# EAGLE design rt_board (EAGLE 5.10)
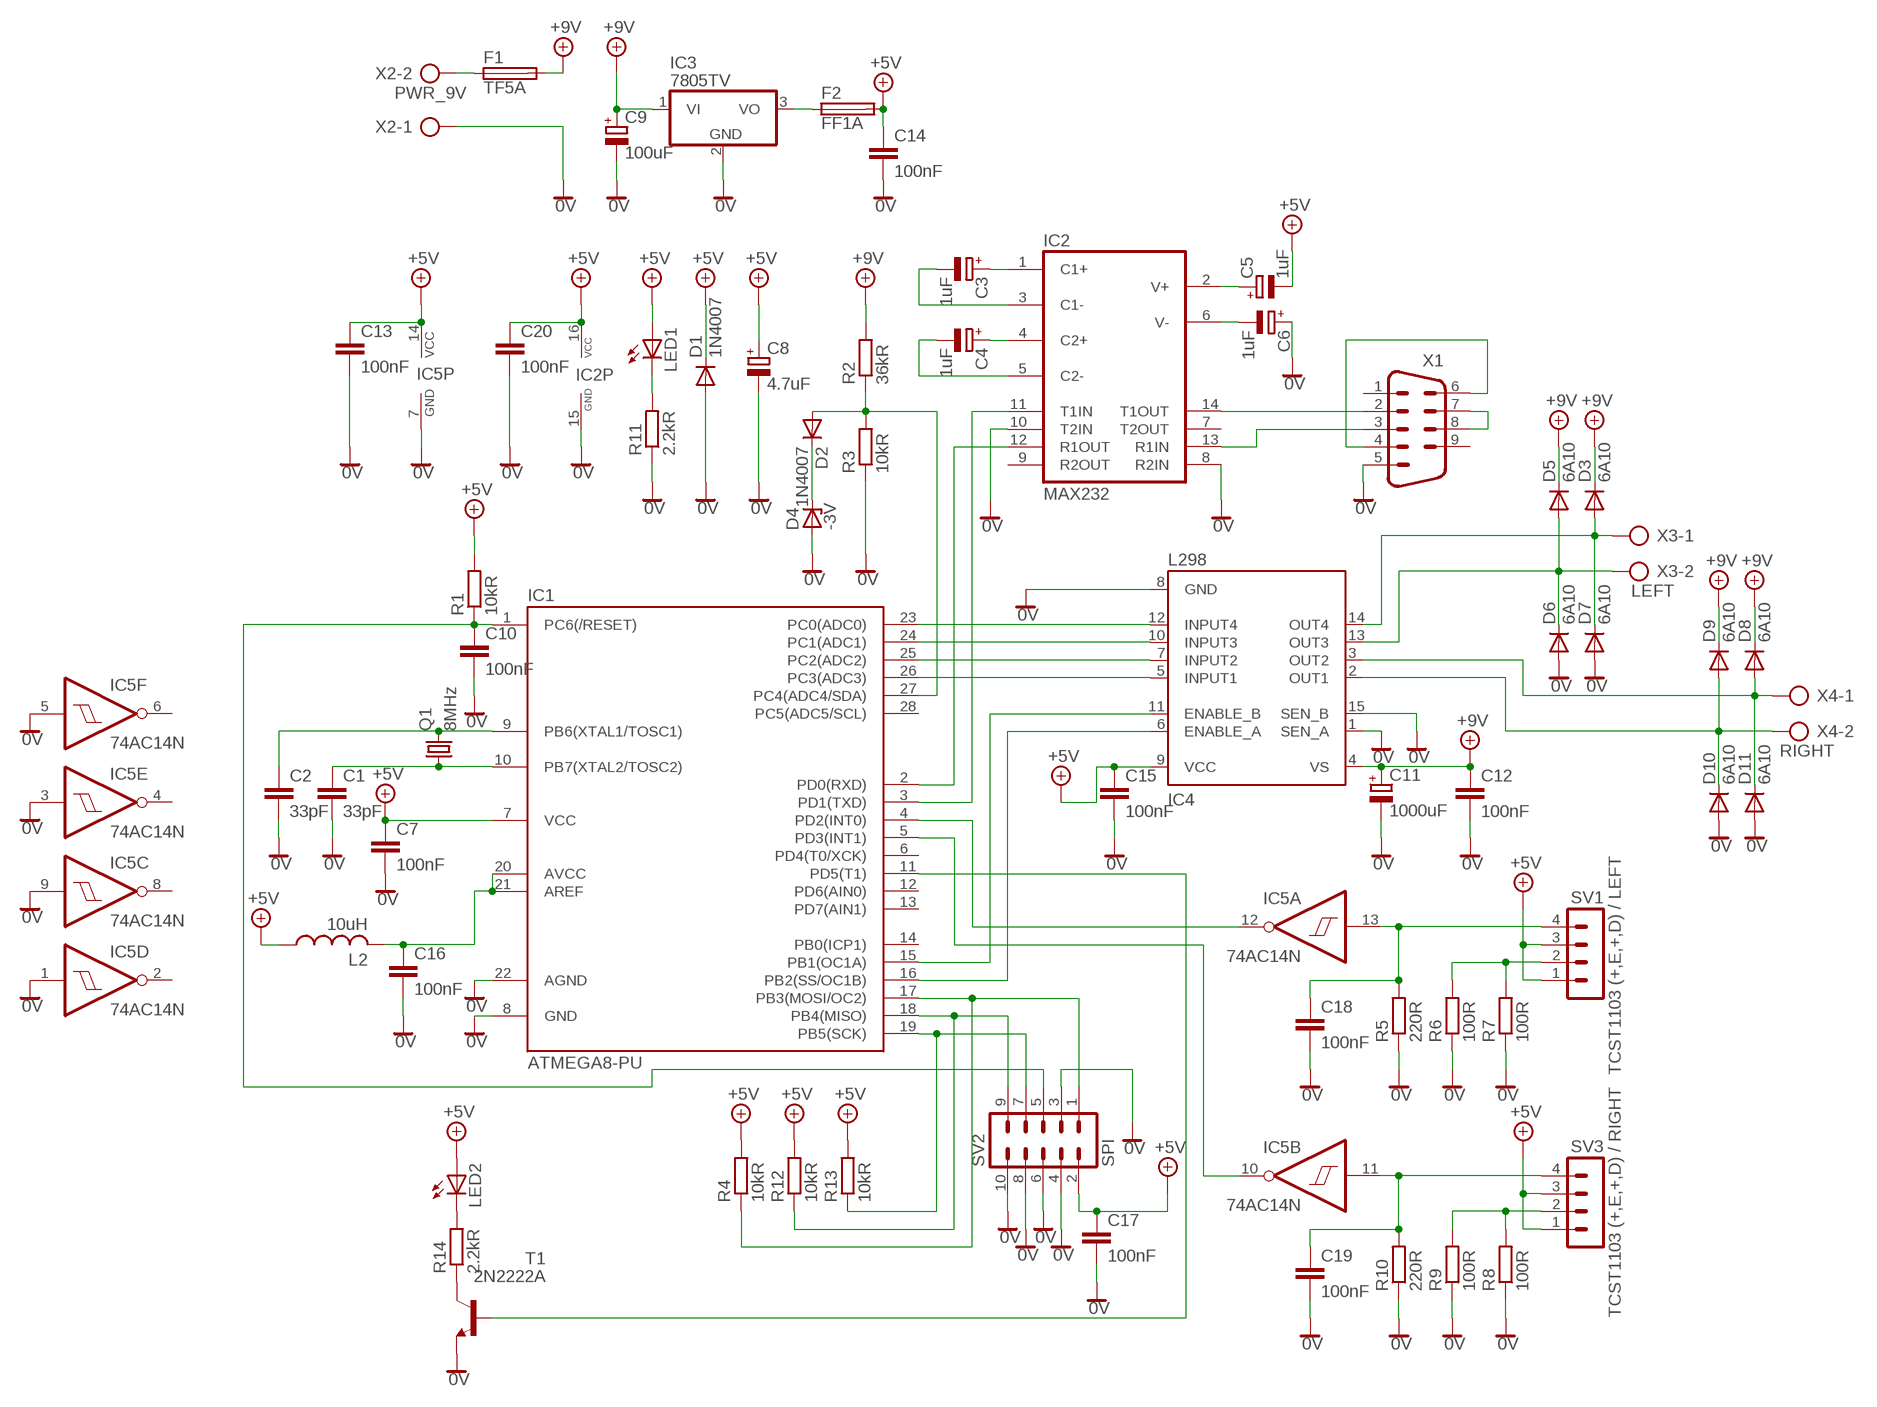
[diagram p0: schematic, sheet 1]

## Parts
C1  33pF  C7.5/3  [C7.5B3]
C2  33pF  C7.5/3  [C7.5B3]
C3  1uF  CPOL-EUE2.5-5  [E2,5-5]
C4  1uF  CPOL-EUE2.5-5  [E2,5-5]
C5  1uF  CPOL-EUE2.5-5  [E2,5-5]
C6  1uF  CPOL-EUE2.5-5  [E2,5-5]
C7  100nF  C7.5/3  [C7.5B3]
C8  4.7uF  CPOL-EUE2.5-7  [E2,5-7]
C9  100uF  CPOL-EUE3.5-10  [E3,5-10]
C10  100nF  C7.5/3  [C7.5B3]
C11  1000uF  CPOL-EUE7.5-16  [E7,5-16]
C12  100nF  C7.5/3  [C7.5B3]
C13  100nF  C7.5/3  [C7.5B3]
C14  100nF  C7.5/3  [C7.5B3]
C15  100nF  C7.5/3  [C7.5B3]
C16  100nF  C7.5/3  [C7.5B3]
C17  100nF  C7.5/3  [C7.5B3]
C18  100nF  C7.5/3  [C7.5B3]
C19  100nF  C7.5/3  [C7.5B3]
C20  100nF  C7.5/3  [C7.5B3]
D1  1N4007  1N4004  [DO41-10]
D2  1N4007  1N4004  [DO41-10]
D3  6A10  UF5400  [DO201-15]
D4  -3V  ZENER-DIODEDO34-7  [DO34Z7]
D5  6A10  UF5400  [DO201-15]
D6  6A10  UF5400  [DO201-15]
D7  6A10  UF5400  [DO201-15]
D8  6A10  UF5400  [DO201-15]
D9  6A10  UF5400  [DO201-15]
D10  6A10  UF5400  [DO201-15]
D11  6A10  UF5400  [DO201-15]
F1  TF5A  SH22  [SH22]
F2  FF1A  SH22  [SH22]
IC1  ATMEGA8-PU  [DIL28-3]
IC2  MAX232  [DIL16]
IC3  7805TV  [TO220V]
IC4  L298  [MULTIWATT-15]
IC5  74AC14N  [DIL14]
L2  10uH  L-US0207/10  [0207/10]
LED1  LED5MM  [LED5MM]
LED2  LED5MM  [LED5MM]
Q1  8MHz  CRYSTALHC49U-V  [HC49U-V]
R1  10kR  R-EU_0207/12  [0207/12]
R2  36kR  R-EU_0207/12  [0207/12]
R3  10kR  R-EU_0207/12  [0207/12]
R4  10kR  R-EU_0207/12  [0207/12]
R5  220R  R-EU_0207/12  [0207/12]
R6  100R  R-EU_0207/12  [0207/12]
R7  100R  R-EU_0207/12  [0207/12]
R8  100R  R-EU_0207/12  [0207/12]
R9  100R  R-EU_0207/12  [0207/12]
R10  220R  R-EU_0207/12  [0207/12]
R11  2.2kR  R-EU_0207/12  [0207/12]
R12  10kR  R-EU_0207/12  [0207/12]
R13  10kR  R-EU_0207/12  [0207/12]
R14  2.2kR  R-EU_0207/12  [0207/12]
SV1  TCST1103 (+,E,+,D) / LEFT  MA04-1  [MA04-1]
SV2  SPI  ML10  [ML10]
SV3  TCST1103 (+,E,+,D) / RIGHT  MA04-1  [MA04-1]
T1  2N2222A  2N2222A-NPN-TO18-EBC  [TO18]
X1  M09HP  [M09HP]
X2  PWR_9V  AK300/2  [AK300/2]
X3  LEFT  AK300/2  [AK300/2]
X4  RIGHT  AK300/2  [AK300/2]

## Nets
0V: C1.2 C2.2 C6.+ C7.2 C8.- C9.- C10.2 C11.- C12.2 C13.2 C14.2 C15.2 C16.2 C17.2 C18.2 C19.2 C20.2 D1.A D4.A D6.A D7.A D10.A D11.A IC1.8(GND) IC1.22(AGND) IC2.8(R2IN) IC2.10(T2IN) IC2.15(GND) IC3.2(GND) IC4.1(SEN_A) IC4.8(GND) IC4.15(SEN_B) IC5.1(D:I) IC5.3(E:I) IC5.5(F:I) IC5.7(P:GND) IC5.9(C:I) R3.1 R5.1 R6.1 R7.1 R8.1 R9.1 R10.1 R11.1 SV2.3 SV2.4 SV2.6 SV2.8 SV2.10 T1.1(E) X1.5 X2.1
+5V: C5.- C7.1 C8.+ C13.1 C14.1 C15.1 C17.1 C20.1 D1.C F2.2 IC1.7(VCC) IC2.16(VCC) IC4.9(VCC) IC5.14(P:VCC) L2.1 LED1.A LED2.A R1.2 R4.2 R12.2 R13.2 SV1.1 SV1.3 SV2.2 SV3.1 SV3.3
+9V: C9.+ C11.+ C12.1 D3.C D5.C D8.C D9.C F1.2 IC3.1(VI) IC4.4(VS) R2.2
N$1: C2.1 IC1.9(PB6(XTAL1/TOSC1)) Q1.2
N$2: C1.1 IC1.10(PB7(XTAL2/TOSC2)) Q1.1
N$3: C10.1 IC1.1(PC6(/RESET)) R1.1 SV2.5
N$4: IC1.2(PD0(RXD)) IC2.12(R1OUT)
N$5: IC1.3(PD1(TXD)) IC2.11(T1IN)
N$6: C3.+ IC2.1(C1+)
N$7: C4.+ IC2.4(C2+)
N$8: C5.+ IC2.2(V+)
N$9: C6.- IC2.6(V-)
N$10: C3.- IC2.3(C1-)
N$11: C4.- IC2.5(C2-)
N$12: IC2.14(T1OUT) X1.2
N$13: IC2.13(R1IN) X1.3
N$14: D2.C D4.C
N$15: X1.7 X1.8
N$16: X1.4 X1.6
N$17: IC1.23(PC0(ADC0)) IC4.12(INPUT4)
N$18: IC1.24(PC1(ADC1)) IC4.10(INPUT3)
N$19: IC1.25(PC2(ADC2)) IC4.7(INPUT2)
N$20: IC1.26(PC3(ADC3)) IC4.5(INPUT1)
N$21: IC1.15(PB1(OC1A)) IC4.11(ENABLE_B)
N$22: IC1.16(PB2(SS/OC1B)) IC4.6(ENABLE_A)
N$24: F1.1 X2.2
N$25: D2.A IC1.27(PC4(ADC4/SDA)) R2.1 R3.2
N$27: IC1.4(PD2(INT0)) IC5.12(A:O)
N$28: IC1.5(PD3(INT1)) IC5.10(B:O)
N$29: IC1.18(PB4(MISO)) R12.1 SV2.9
N$30: IC1.19(PB5(SCK)) R13.1 SV2.7
N$31: IC1.17(PB3(MOSI/OC2)) R4.1 SV2.1
N$32: C18.1 IC5.13(A:I) R5.2 SV1.4
N$33: R6.2 R7.2 SV1.2
N$34: F2.1 IC3.3(VO)
N$35: D3.A D7.C IC4.14(OUT4) X3.1
N$36: D5.A D6.C IC4.13(OUT3) X3.2
N$37: D8.A D11.C IC4.3(OUT2) X4.1
N$38: D9.A D10.C IC4.2(OUT1) X4.2
N$39: C19.1 IC5.11(B:I) R10.2 SV3.4
N$40: R8.2 R9.2 SV3.2
N$41: LED1.K(C) R11.2
N$46: LED2.K(C) R14.2
N$47: C16.1 IC1.20(AVCC) IC1.21(AREF) L2.2
N$48: R14.1 T1.3(C)
N$49: IC1.11(PD5(T1)) T1.2(B)
Unconnected: IC1.6(PD4(T0/XCK)) IC1.12(PD6(AIN0)) IC1.13(PD7(AIN1)) IC1.14(PB0(ICP1)) IC1.28(PC5(ADC5/SCL)) IC2.7(T2OUT) IC2.9(R2OUT) IC5.2(D:O) IC5.4(E:O) IC5.6(F:O) IC5.8(C:O) X1.1 X1.9

## Library data of the parts
C1 C2 C7 C10 C12-C20 = capacitor-wima:C: CAPACITOR naming: grid - package width
C3-C6 C8 C9 C11 = rcl:CPOL-EU: POLARIZED CAPACITOR, European symbol
D1 D2 = diode:1N4004: DIODE general purpose rectifier, 1 A
D3 D5-D11 = diode:UF5400: DIODE ultra fast rectifier, 3 A
D4 = diode:ZENER-DIODE: Z-Diode
F1 F2 = fuse:SH22: FUSE HOLDER CS PFP30, Schukat
IC1 = atmega8:ATMEGA8-PU
IC2 = maxim:MAX232: RS232 TRANSEIVER
IC3 = linear:78*: Positive VOLTAGE REGULATOR Source: http://cache.national.com/ds/LM/LM78L05.pdf http://www.fairchildsemi.com/ds/LM/LM7805.pdf
IC4 = st-microelectronics:L298: DUAL FULL-BRIDGE DRIVER
IC5 = 74xx-eu:74*14: Hex schmitt trigger INVERTER
L2 = rcl:L-US: INDUCTOR, American symbol
LED1 LED2 = led:LED: LED OSRAM: - CHIPLED LG R971, LG N971, LY N971, LG Q971, LY Q971, LO R971, LY R971 LH N974, LH R974 LS Q976, LO Q976, LY Q976 LO Q996 - Hyper CHIPLED LW Q18S LB Q993, LB Q99A, LB R99A - SideLED LS A670, LO A670, LY A670, LG A670, LP A670 LB A673, LV A673, LT A673, LW A673 LH A674 LY A675 LS A676, LA A676, LO A676, LY A676, LW A676 LS A679, LY A679, LG A679 - Hyper Micro SIDELED® LS Y876, LA Y876, LO Y876, LY Y876 LT Y87S - SmartLED LW L88C, LW L88S LB L89C, LB L89S, LG L890 LS L89K, LO L89K, LY L89K LS L896, LA L896, LO L896, LY L896 - TOPLED LS T670, LO T670, LY T670, LG T670, LP T670 LSG T670, LSP T670, LSY T670, LOP T670, LYG T670 LG T671, LOG T671, LSG T671 LB T673, LV T673, LT T673, LW T673 LH T674 LS T676, LA T676, LO T676, LY T676, LB T676, LH T676, LSB T676, LW T676 LB T67C, LV T67C, LT T67C, LS T67K, LO T67K, LY T67K, LW E67C LS E67B, LA E67B, LO E67B, LY E67B, LB E67C, LV E67C, LT E67C LW T67C LS T679, LY T679, LG T679 LS T770, LO T770, LY T770, LG T770, LP T770 LB T773, LV T773, LT T773, LW T773 LH T774 LS E675, LA E675, LY E675, LS T675 LS T776, LA T776, LO T776, LY T776, LB T776 LHGB T686 LT T68C, LB T68C - Hyper Mini TOPLED® LB M676 - Mini TOPLED Santana® LG M470 LS M47K, LO M47K, LY M47K Source: http://www.osram.convergy.de LUXEON: - LUMILED® LXK2-PW12-R00, LXK2-PW12-S00, LXK2-PW14-U00, LXK2-PW14-V00 LXK2-PM12-R00, LXK2-PM12-S00, LXK2-PM14-U00 LXK2-PE12-Q00, LXK2-PE12-R00, LXK2-PE12-S00, LXK2-PE14-T00, LXK2-PE14-U00 LXK2-PB12-K00, LXK2-PB12-L00, LXK2-PB12-M00, LXK2-PB14-N00, LXK2-PB14-P00, LXK2-PB14-Q00 LXK2-PR12-L00, LXK2-PR12-M00, LXK2-PR14-Q00, LXK2-PR14-R00 LXK2-PD12-Q00, LXK2-PD12-R00, LXK2-PD12-S00 LXK2-PH12-R00, LXK2-PH12-S00 LXK2-PL12-P00, LXK2-PL12-Q00, LXK2-PL12-R00 Source: www.luxeon.com KINGBRIGHT: KA-3528ASYC Source: www.kingbright.com
Q1 = crystal:CRYSTAL: CRYSTAL
R1-R14 = resistor:R-EU_: RESISTOR, European symbol
SV1 SV3 = con-lstb:MA04-1: PIN HEADER
SV2 = con-harting-ml:ML10: HARTING
T1 = transistor-neu-to92:*-NPN-: NPN Transistror
X1 = con-subd:M09: SUB-D
X2-X4 = con-ptr500:AK300/2: CONNECTOR

## Board
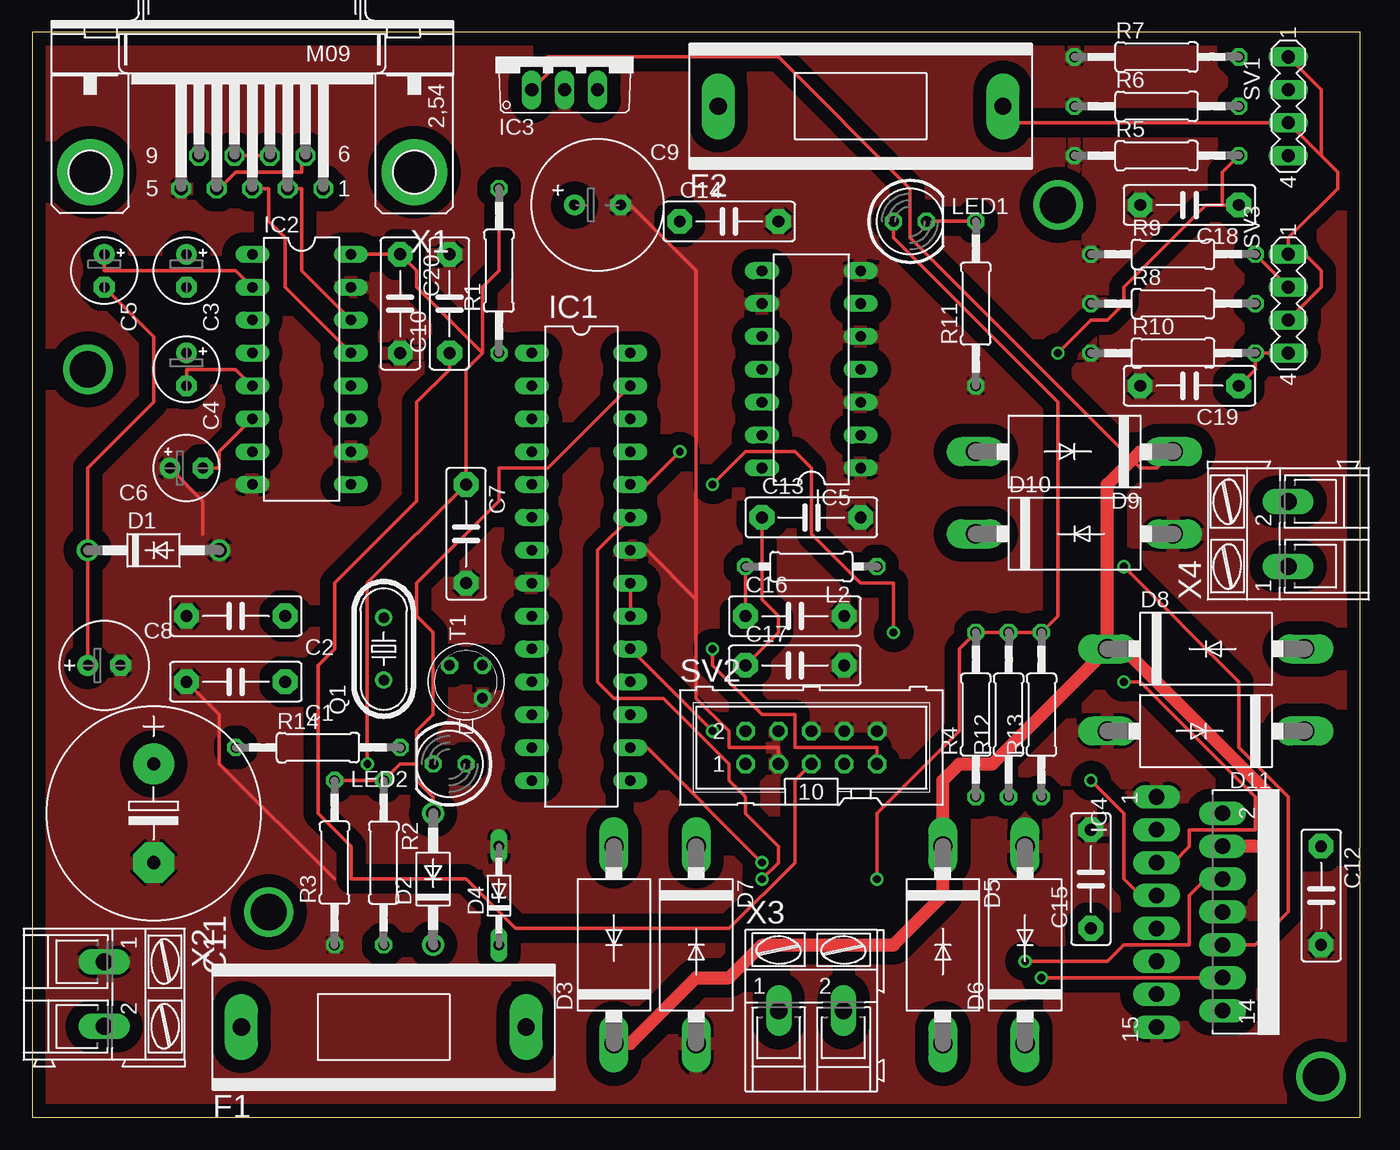
[diagram p1: board, top side]
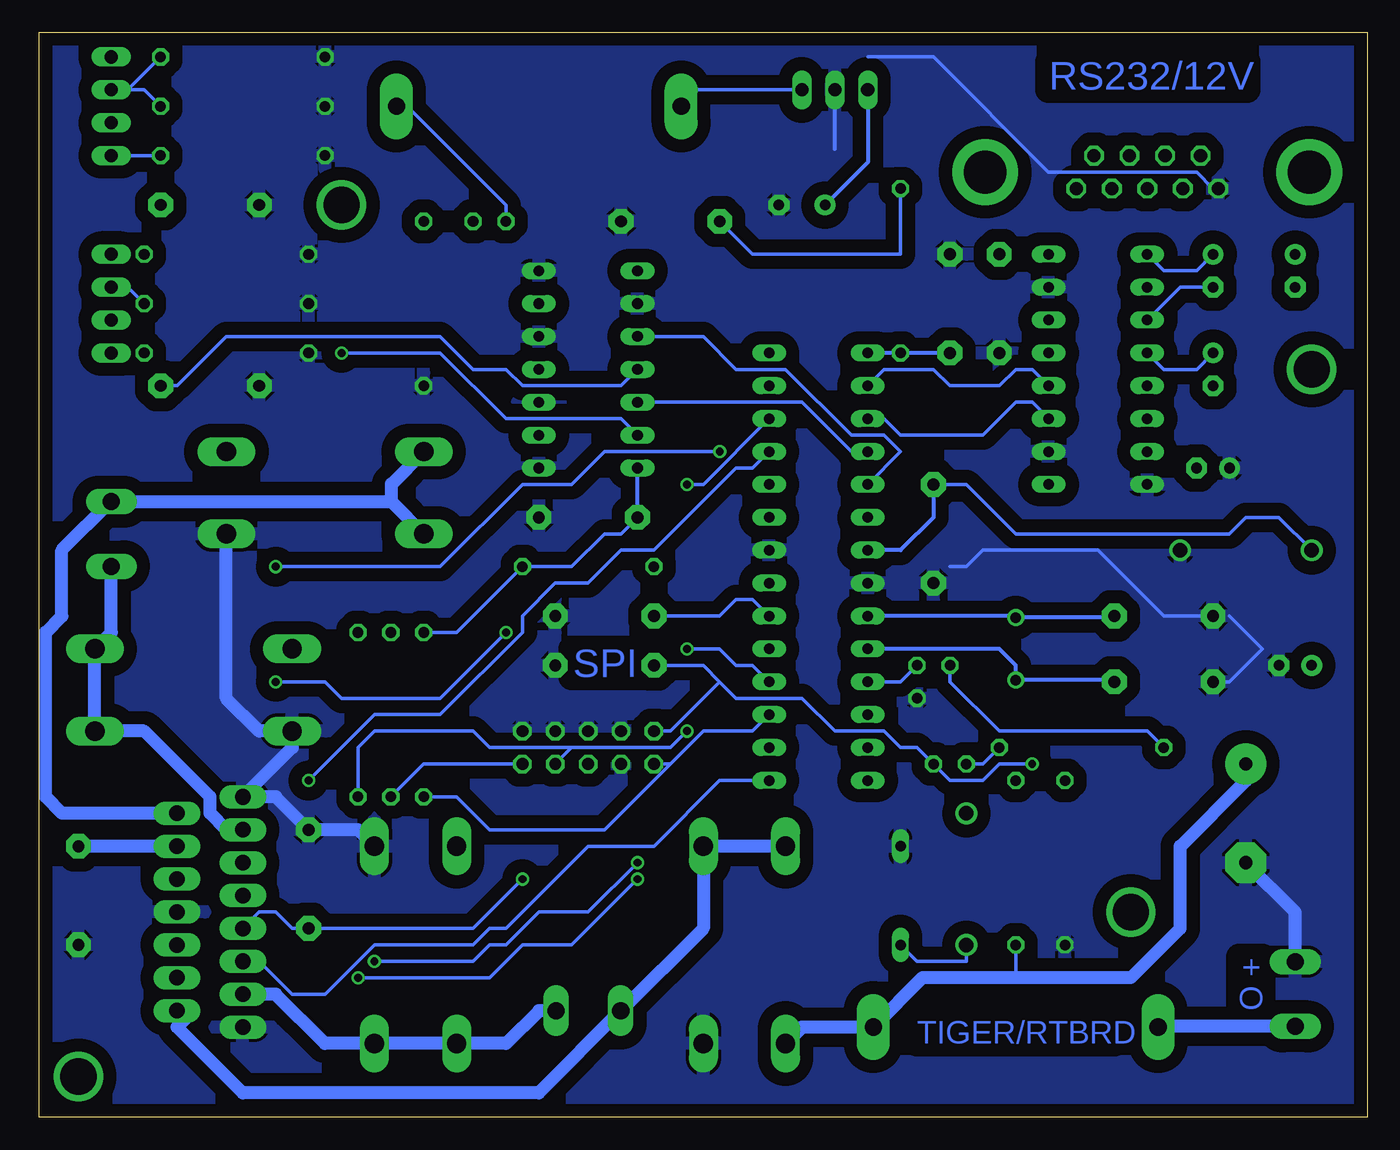
[diagram p2: board, bottom side, seen from below]

Size 102.54 x 83.81 mm. Coordinates in mm from the lower left corner, seen from the top.
Outline: 0,0 102.54,0 102.54,83.81 0,83.81 0,0
Copper layers (1*16): Top 0.035mm / dielectric 1.5mm / Bottom 0.035mm
Design rules "default": minimum track width 10mil, minimum drill 24mil, track to track 8mil, track to pad 8mil, pad to pad 8mil, via to via 8mil, smd to smd 8mil, copper to edge 40mil, drill to drill 8mil, minimum pad ring 10mil, minimum via ring 8mil, stop-mask expansion 4mil, vias tented up to drill 0mil, thermal gap 10mil

### Footprints (pad centres in the part's own frame; a part is rotated, then mirrored left to right if it is on the bottom)
C7.5B3 = drill 0.914 pad 1.905 octagon: 1 -3.81,0; 2 3.81,0
E2,5-5 = drill 0.813 pad 1.6 round: + -1.27,0 | drill 0.813 pad 1.6 octagon: - 1.27,0
E2,5-7 = drill 0.813 pad 1.6 round: + -1.27,0 | drill 0.813 pad 1.6 octagon: - 1.27,0
E3,5-10 = drill 0.813 pad 1.6 round: + -1.778,0 | drill 0.813 pad 1.6 octagon: - 1.778,0
E7,5-16 = drill 1.016 pad 3.15 round: + -3.81,0 | drill 1.016 pad 3.15 octagon: - 3.81,0
DO41-10 = drill 1.118 round: A 5.08,0; C -5.08,0
DO201-15 = drill 1.499 long: A 7.62,0; C -7.62,0
DO34Z7 = drill 0.813 long: A 3.81,0; C -3.81,0
SH22 = drill 1.321 pad 2.54 long: 1 -10.998,0; 2 10.998,0
DIL28-3 = drill 0.813 long: 1 -16.51,-3.81; 2 -13.97,-3.81; 3 -11.43,-3.81; 4 -8.89,-3.81; 5 -6.35,-3.81; 6 -3.81,-3.81; 7 -1.27,-3.81; 8 1.27,-3.81; 9 3.81,-3.81; 10 6.35,-3.81; 11 8.89,-3.81; 12 11.43,-3.81; 13 13.97,-3.81; 14 16.51,-3.81; 15 16.51,3.81; 16 13.97,3.81; 17 11.43,3.81; 18 8.89,3.81; 19 6.35,3.81; 20 3.81,3.81; 21 1.27,3.81; 22 -1.27,3.81; 23 -3.81,3.81; 24 -6.35,3.81; 25 -8.89,3.81; 26 -11.43,3.81; 27 -13.97,3.81; 28 -16.51,3.81
DIL16 = drill 0.813 long: 1 -8.89,-3.81; 2 -6.35,-3.81; 3 -3.81,-3.81; 4 -1.27,-3.81; 5 1.27,-3.81; 6 3.81,-3.81; 7 6.35,-3.81; 8 8.89,-3.81; 9 8.89,3.81; 10 6.35,3.81; 11 3.81,3.81; 12 1.27,3.81; 13 -1.27,3.81; 14 -3.81,3.81; 15 -6.35,3.81; 16 -8.89,3.81
TO220V = drill 1.016 long: 1 -2.54,-2.54; 2 0,-2.54; 3 2.54,-2.54
MULTIWATT-15 = drill 1.2 long: 1 -8.89,-7.62; 2 -7.62,-2.54; 3 -6.35,-7.62; 4 -5.08,-2.54; 5 -3.81,-7.62; 6 -2.54,-2.54; 7 -1.27,-7.62; 8 0,-2.54; 9 1.27,-7.62; 10 2.54,-2.54; 11 3.81,-7.62; 12 5.08,-2.54; 13 6.35,-7.62; 14 7.62,-2.54; 15 8.89,-7.62
DIL14 = drill 0.813 long: 1 -7.62,-3.81; 2 -5.08,-3.81; 3 -2.54,-3.81; 4 0,-3.81; 5 2.54,-3.81; 6 5.08,-3.81; 7 7.62,-3.81; 8 7.62,3.81; 9 5.08,3.81; 10 2.54,3.81; 11 0,3.81; 12 -2.54,3.81; 13 -5.08,3.81; 14 -7.62,3.81
0207/10 = drill 0.813 octagon: 1 -5.08,0; 2 5.08,0
LED5MM = drill 0.813 octagon: A -1.27,0; K 1.27,0
HC49U-V = drill 0.813 round: 1 -2.413,0; 2 2.413,0
0207/12 = drill 0.813 octagon: 1 -6.35,0; 2 6.35,0
MA04-1 = drill 1.016 long: 1 -3.81,0; 2 -1.27,0; 3 1.27,0; 4 3.81,0
ML10 = drill 0.914 octagon: 1 -5.08,-1.27; 2 -5.08,1.27; 3 -2.54,-1.27; 4 -2.54,1.27; 5 0,-1.27; 6 0,1.27; 7 2.54,-1.27; 8 2.54,1.27; 9 5.08,-1.27; 10 5.08,1.27
TO18 = drill 0.813 octagon: 1 -1.27,-1.27; 2 1.27,-1.27; 3 1.27,1.27
M09HP = drill 1.016 octagon: 1 -5.486,1.27; 2 -2.743,1.27; 3 0,1.27; 4 2.743,1.27; 5 5.486,1.27; 6 -4.115,-1.27; 7 -1.372,-1.27; 8 1.372,-1.27; 9 4.115,-1.27 | drill 3.302 pad 5.08 round: G1 -12.522,0; G2 12.522,0
AK300/2 = drill 1.321 long: 1 -2.515,0; 2 2.489,0

### Placement (x,y rotation side)
C1  15.71,33.65 180 top
C2  15.71,38.73 180 top
C3  11.9,65.4 270 top
C4  11.9,57.78 270 top
C5  5.55,65.4 270 top
C6  11.9,50.16 0 top
C7  33.49,45.08 270 top
C8  5.55,34.92 0 top
C9  43.65,70.48 0 top
C10  32.22,62.86 90 top
C11  9.36,23.49 270 top
C12  99.53,17.14 270 top
C13  60.16,46.35 0 top
C14  53.81,69.21 0 top
C15  81.75,18.41 90 top
C16  58.89,38.73 0 top
C17  58.89,34.92 0 top
C18  89.37,70.48 180 top
C19  89.37,56.51 180 top
C20  28.41,62.86 270 top
D1  9.36,43.81 0 top
D2  30.95,18.41 90 top
D3  44.92,13.33 90 top
D4  36.03,17.14 90 top
D5  70.32,13.33 270 top
D6  76.67,13.33 90 top
D7  51.27,13.33 270 top
D8  90.64,36.19 0 top
D9  80.48,51.43 180 top
D10  80.48,45.08 0 top
D11  90.64,29.84 180 top
F1  27.14,6.98 0 top
F2  63.97,78.1 0 top
IC1  42.38,42.54 270 top
IC2  20.79,57.78 270 top
IC3  41.11,81.91 0 top
IC4  94.45,15.87 270 top
IC5  60.16,57.78 90 top
L2  60.16,42.54 180 top
LED1  67.78,69.21 0 top
LED2  32.22,27.3 180 top
Q1  27.14,36.19 90 top
R1  36.03,65.4 90 top
R2  27.14,19.68 270 top
R3  23.33,19.68 90 top
R4  72.86,31.11 90 top
R5  86.83,74.29 0 top
R6  86.83,78.1 0 top
R7  86.83,81.91 0 top
R8  88.1,62.86 0 top
R9  88.1,66.67 0 top
R10  88.1,59.05 0 top
R11  72.86,62.86 90 top
R12  75.4,31.11 90 top
R13  77.94,31.11 90 top
R14  22.06,28.57 0 top
SV1  96.99,78.1 270 top
SV2  60.16,28.57 0 top
SV3  96.99,62.86 270 top
T1  33.49,33.65 90 top
X1  16.98,73.02 180 top
X2  5.55,9.52 270 top
X3  60.16,8.25 0 top
X4  96.99,45.08 90 top

### Tracks (layer width: path | path; a pad name or v marks a point on that pad's centre or on a via)
0V
  Top 0.254: C6.+ 13.17,47.62 13.17,45.08 | 51.27,40 51.27,32.38 53.81,29.84 53.81,28.57 57.62,28.57 SV2.3 | 51.27,40 47.46,43.81 IC1.22 | 46.19,70.48 51.27,65.4 51.27,40 | 23.33,18.41 14.44,27.3 14.44,31.11 C1.2
  Bottom 0.254: 38.57,81.91 33.49,81.91 24.6,73.02 13.17,73.02 11.9,71.75 X1.5 | 32.22,42.54 30.95,42.54 29.68,43.81 20.79,43.81 15.71,38.73 C2.2 | 10.63,38.73 8.09,36.19 10.63,33.65 C1.2
  Bottom 0.305: 41.11,74.8 IC3.2
  Bottom 1.016: D10.A 88.1,32.38 85.56,29.84 D11.A 83.02,28.57 IC4.1 84.29,24.76 C15.2 77.94,22.22 D6.A | X2.1 5.55,15.87 C11.-
  pour Bottom (isolate 1.016): 0.47,0.63 0.47,83.18 102.07,83.18 102.07,0.63
  pour Top (isolate 1.016): 0.47,0.63 0.47,83.18 102.07,83.18 102.07,0.63
+5V  (via drill 0.61)
  Top 0.254: v65.24,18.41 65.24,23.49 71.59,29.84 71.59,36.19 R4.2 R12.2 R13.2 79.21,38.73 79.21,55.24 66.51,67.94 LED1.A | C17.1 57.62,37.46 57.62,38.73 56.35,40 C13.1 | C8.+ D1.C 4.28,50.16 9.36,55.24 9.36,60.32 C5.- | 34.76,59.05 33.49,57.78 C7.1 25.87,41.27 v25.87,27.3 | 34.76,59.05 34.76,64.13 36.03,65.4 R1.2 | IC2.16 C20.1 29.68,65.4 29.68,64.13 34.76,59.05 | SV3.3 99.53,64.13 99.53,65.4 98.26,66.67 SV3.1 96.99,67.94 100.8,71.75 100.8,73.02 99.53,74.29 | 99.53,74.29 SV1.3 75.4,76.83 75.4,78.1 F2.2 | SV1.1 99.53,79.37 99.53,74.29
  Bottom 0.254: 50,33.65 51.27,34.92 C17.1 | 50,33.65 48.73,32.38 43.65,32.38 41.11,29.84 37.3,29.84 36.03,28.57 34.76,28.57 LED2.A 32.22,26.03 29.68,26.03 28.41,27.3 v25.87,27.3 | SV2.2 53.81,29.84 50,33.65 | IC4.9 85.56,15.87 84.29,15.87 83.02,14.6 C15.1 69.05,14.6 v65.24,18.41 | R4.2 70.32,37.46 L2.1 61.43,42.54 58.89,45.08 57.62,45.08 C13.1 | R1.2 36.03,66.67 47.46,66.67 C14.1 | D1.C 6.82,46.35 9.36,46.35 10.63,45.08 27.14,45.08 30.95,48.89 C7.1 | LED1.A 66.51,70.48 74.13,78.1 F2.2
  Bottom 0.305: C7.1 33.49,46.35 36.03,43.81 IC1.7 | C13.1 IC5.14
+9V
  Top 0.254: D9.C 86.83,50.16 85.56,50.16 67.78,67.94 67.78,71.75 57.62,81.91 39.84,81.91 39.84,80.64 IC3.1
  Top 1.016: D9.C 85.56,51.43 83.02,48.89 D8.C | D8.C 84.29,36.19 95.72,24.76 95.72,20.95 IC4.4 | D3.C 46.19,5.71 51.27,10.79 53.81,10.79 56.35,13.33 66.51,13.33 70.32,17.14 D5.C 70.32,26.03 71.59,27.3 74.13,27.3 D8.C
  Bottom 0.254: 27.14,10.79 R2.2
  Bottom 0.305: IC3.1 38.57,73.78 C9.+
  Bottom 1.016: D3.C 43.65,6.98 F1.2 34.33,10.79 27.14,10.79 18.25,10.79 14.44,14.6 14.44,20.95 9.36,26.03 C11.+ | IC4.4 C12.1
N$1
  Bottom 0.305: IC1.9 27.27,38.73 Q1.2 19.65,38.6 C2.1
N$2
  Bottom 0.305: IC1.10 28.41,36.19 27.14,34.92 Q1.1 19.65,33.78 C1.1
N$3
  Top 0.254: SV2.5 58.89,26.03 58.89,19.68 53.81,14.6 37.3,14.6 33.49,18.41 24.6,18.41 24.6,20.95 22.06,23.49 22.06,34.92 23.33,36.19 23.33,41.27 29.68,47.62 29.68,55.24 32.22,57.78 C10.1
  Bottom 0.305: IC1.1 R1.1 C10.1
N$4
  Bottom 0.254: IC2.12 25.87,57.78 27.14,57.78 28.41,56.51 32.22,56.51 33.49,57.78 37.3,57.78 IC1.2
N$5
  Bottom 0.254: IC2.11 25.87,55.24 27.14,55.24 29.68,52.7 36.03,52.7 37.3,53.97 IC1.3
N$6
  Bottom 0.254: IC2.1 15.71,65.4 13.17,65.4 C3.+
N$7
  Bottom 0.254: IC2.4 15.71,57.78 13.17,57.78 C4.+
N$8
  Top 0.254: IC2.2 15.71,65.4 5.55,65.4 C5.+
N$9
  Top 0.254: IC2.6 14.44,51.43 14.44,50.16 C6.-
N$10
  Bottom 0.254: IC2.3 14.44,64.13 C3.-
N$11
  Top 0.254: IC2.5 15.71,57.78 11.9,57.78 C4.-
N$12
  Top 0.254: IC2.14 20.79,65.4 20.79,71.75 X1.2 19.52,71.75
N$13
  Top 0.254: IC2.13 19.52,64.13 19.52,67.94 18.25,69.21 18.25,71.75 X1.3
N$14
  Bottom 0.254: D4.C 34.76,12.06 30.95,12.06 D2.C
N$15
  Top 0.254: X1.8 X1.7
N$16
  Top 0.254: X1.4 14.44,71.75 15.71,73.02 20.79,73.02 20.79,74.29 X1.6
N$17  (via drill 0.61)
  Top 0.254: IC1.23 43.65,43.81 43.65,33.65 44.92,32.38 48.73,32.38 53.81,27.3 53.81,26.03 55.08,24.76 55.08,23.49 57.62,20.95 57.62,19.68 v56.35,18.41 | v77.94,10.79 IC4.12
  Bottom 0.254: v56.35,18.41 61.43,13.33 65.24,13.33 67.78,10.79 v77.94,10.79
N$18  (via drill 0.61)
  Top 0.254: IC1.24 47.46,48.89 v50,51.43 | v84.29,42.54 93.18,33.65 93.18,28.57 96.99,24.76 96.99,15.87 94.45,13.33 IC4.10
  Bottom 0.254: v50,51.43 58.89,51.43 61.43,48.89 65.24,48.89 71.59,42.54 v84.29,42.54
N$19  (via drill 0.61)
  Top 0.254: v81.75,26.03 84.29,23.49 84.29,18.41 85.56,17.14 IC4.7
  Bottom 0.254: IC1.25 47.46,50.16 48.73,50.16 55.08,43.81 57.62,43.81 60.16,41.27 62.7,41.27 65.24,38.73 65.24,37.46 71.59,31.11 76.67,31.11 v81.75,26.03
N$20  (via drill 0.61)
  Top 0.254: v52.54,48.89 55.08,51.43 58.89,51.43 60.16,50.16 60.16,45.08 63.97,41.27 66.51,41.27 v66.51,37.46 | v84.29,33.65 85.56,33.65 94.45,24.76 94.45,22.22 89.37,22.22 89.37,20.95 88.1,19.68 IC4.5
  Bottom 0.254: IC1.26 51.27,48.89 v52.54,48.89 | v66.51,37.46 71.59,32.38 79.21,32.38 80.48,33.65 v84.29,33.65
N$21
  Bottom 0.254: IC1.15 50,26.03 55.08,20.95 60.16,20.95 66.51,14.6 67.78,14.6 69.05,13.33 76.67,13.33 80.48,9.52 83.02,9.52 85.56,12.06 IC4.11
N$22  (via drill 0.61)
  Top 0.254: IC1.16 47.46,28.57 v56.35,19.68 | v76.67,12.06 83.02,12.06 84.29,13.33 89.37,13.33 89.37,17.14 90.64,18.41 IC4.6
  Bottom 0.254: v56.35,19.68 60.16,15.87 63.97,15.87 66.51,13.33 67.78,13.33 69.05,12.06 v76.67,12.06
N$24
  Bottom 1.016: X2.2 16.09,7.03 F1.1
N$25
  Top 0.254: R3.2 R2.1 28.41,27.3 29.68,27.3 | IC1.27 39.84,50.16 36.03,50.16 36.03,47.62 29.68,41.27 29.68,38.73 30.95,37.46 30.95,31.11 29.68,29.84 29.68,27.3 | 29.68,27.3 29.68,26.03 30.95,24.76 D2.A
N$27
  Bottom 0.254: IC1.4 39.84,51.43 43.65,55.24 IC5.12
N$28
  Bottom 0.254: IC1.5 36.03,51.43 37.3,52.7 39.84,52.7 44.92,57.78 48.73,57.78 51.27,60.32 IC5.10
N$29  (via drill 0.61)
  Top 0.254: v52.54,36.19 52.54,34.92 56.35,31.11 58.89,31.11 58.89,28.57 65.24,28.57 SV2.9
  Bottom 0.254: IC1.18 47.46,34.92 48.73,34.92 50,36.19 v52.54,36.19 | R12.1 72.86,27.3 SV2.9
N$30  (via drill 0.61)
  Top 0.254: IC1.19 v52.54,29.84
  Bottom 0.254: v52.54,29.84 53.81,28.57 61.43,28.57 | 61.43,28.57 SV2.7 | R13.1 77.94,28.57 76.67,29.84 69.05,29.84 67.78,28.57 61.43,28.57
N$31
  Bottom 0.254: IC1.17 47.46,29.84 51.27,29.84 53.81,27.3 | 53.81,27.3 SV2.1 | R4.1 70.32,24.76 67.78,22.22 58.89,22.22 53.81,27.3
N$32  (via drill 0.61)
  Top 0.254: v79.21,59.05 81.75,61.59 83.02,61.59 84.29,62.86 84.29,64.13 90.64,70.48 91.91,70.48 | 91.91,70.48 C18.1 | R5.2 91.91,73.02 91.91,70.48
  Bottom 0.254: R5.2 SV1.4 | IC5.13 57.62,53.97 66.51,53.97 71.59,59.05 v79.21,59.05
N$33
  Bottom 0.254: R6.2 94.45,79.37 95.72,79.37 | 95.72,79.37 R7.2 | 95.72,79.37 SV1.2
N$34
  Bottom 0.254: IC3.3 52.54,79.37 53.81,78.1 F2.1
N$35
  Bottom 1.016: IC4.14 90.64,8.25 91.91,6.98 86.83,1.9 63.97,1.9 57.65,8.23 X3.1 51.27,14.62 D7.C D3.A
N$36
  Bottom 1.016: X3.2 63.97,8.25 66.51,5.71 D5.A D6.C 80.48,5.71 84.29,9.52 IC4.13
N$37
  Bottom 1.016: X4.1 96.99,37.46 D8.A D11.C 94.45,29.84 89.37,24.76 89.37,23.49 88.1,22.22 IC4.3
N$38
  Bottom 1.016: 75.35,47.57 X4.2 97.04,47.57 100.8,43.81 100.8,38.73 102.07,37.46 102.07,24.76 100.8,23.49 IC4.2 | 75.35,47.57 D10.C | 75.35,47.57 75.35,48.94 D9.A
N$39
  Top 0.254: C19.1 94.45,57.78 R10.2 SV3.4
  Bottom 0.254: IC5.11 57.62,56.51 65.24,56.51 66.51,57.78 69.05,57.78 71.59,60.32 88.1,60.32 91.91,56.51 C19.1
N$40
  Top 0.254: SV3.2 R9.2
  Bottom 0.254: R8.2 95.72,64.13 SV3.2
N$41
  Top 0.254: LED1.K R11.2
N$42  (via drill 2.8)
  other vias: 4.28,57.78
N$43  (via drill 2.8)
  other vias: 79.21,70.48
N$44  (via drill 2.8)
  other vias: 18.25,15.87
N$45  (via drill 2.8)
  other vias: 99.53,3.17
N$46
  Bottom 0.254: R14.2 29.68,27.3 LED2.K
N$47
  Top 0.254: IC1.20 IC1.21 | C16.1 L2.2
  Bottom 0.254: IC1.20 47.46,40 48.73,40 50,38.73 C16.1
N$48
  Bottom 0.254: R14.1 16.98,29.84 28.41,29.84 32.22,33.65 T1.3
N$49
  Bottom 0.254: T1.2 36.03,33.65 IC1.11

### Text on the board
Bottom: RS232/12V | SPI | O + | TIGER/RTBRD